# EAGLE design indicator (EAGLE 5.10)
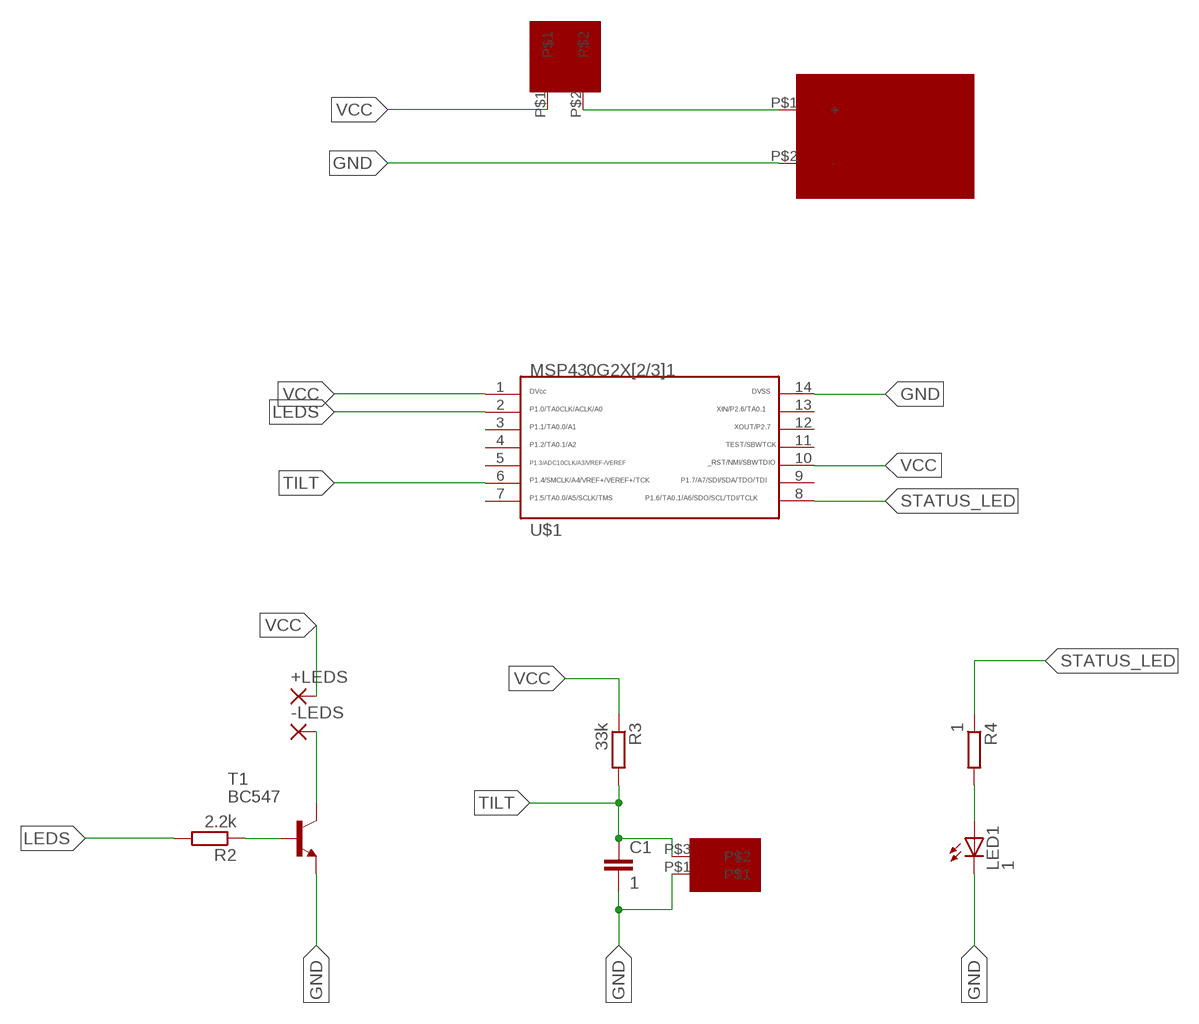
[diagram p0: schematic, sheet 1]

## Parts
+LEDS  PAD-TERMINAL  [1,6/0,8]
-LEDS  PAD-TERMINAL  [1,6/0,8]
BATTERY  BATTERY_HOLDER_CR2032  [BATTERY]
C1  1  C5P  [C050-030-075]
LED1  1  LED5MM  [LED5MM]
R2  2.2k  R  [0207/10]
R3  33k  R  [0207/10]
R4  1  R  [0207/10]
SWITCH  SPDT  [SPDT_SWTICHT]
T1  BC547  [TO92]
TILT  TILT_SWITCH  [TILT_SWITCH]
U$1  G2X[2/3]1---N14  [N14]

## Nets
GND: BATTERY.P$2(-) C1.2 LED1.K(C) T1.1(E) TILT.P$1 U$1.14
LEDS: R2.2 U$1.2
N$2: -LEDS.1(P) T1.3(C)
N$3: R2.1 T1.2(B)
N$11: LED1.A R4.2
N$13: BATTERY.P$1(+) SWITCH.P$2
STATUS_LED: R4.1 U$1.8
TILT: C1.1 R3.2 TILT.P$3 U$1.6
VCC: +LEDS.1(P) R3.1 SWITCH.P$1 U$1.1 U$1.10
Unconnected: U$1.3 U$1.4 U$1.5 U$1.7 U$1.9 U$1.11 U$1.12 U$1.13

## Library data of the parts
+LEDS -LEDS = arm-parts:PAD-TERMINAL: THROUGH-HOLE PAD
BATTERY = Battery_holder_cr2032:BATTERY_HOLDER_CR2032
C1 = arm-parts:C: Capacitor
LED1 = led:LED: LED OSRAM: - CHIPLED LG R971, LG N971, LY N971, LG Q971, LY Q971, LO R971, LY R971 LH N974, LH R974 LS Q976, LO Q976, LY Q976 LO Q996 - Hyper CHIPLED LW Q18S LB Q993, LB Q99A, LB R99A - SideLED LS A670, LO A670, LY A670, LG A670, LP A670 LB A673, LV A673, LT A673, LW A673 LH A674 LY A675 LS A676, LA A676, LO A676, LY A676, LW A676 LS A679, LY A679, LG A679 - Hyper Micro SIDELED® LS Y876, LA Y876, LO Y876, LY Y876 LT Y87S - SmartLED LW L88C, LW L88S LB L89C, LB L89S, LG L890 LS L89K, LO L89K, LY L89K LS L896, LA L896, LO L896, LY L896 - TOPLED LS T670, LO T670, LY T670, LG T670, LP T670 LSG T670, LSP T670, LSY T670, LOP T670, LYG T670 LG T671, LOG T671, LSG T671 LB T673, LV T673, LT T673, LW T673 LH T674 LS T676, LA T676, LO T676, LY T676, LB T676, LH T676, LSB T676, LW T676 LB T67C, LV T67C, LT T67C, LS T67K, LO T67K, LY T67K, LW E67C LS E67B, LA E67B, LO E67B, LY E67B, LB E67C, LV E67C, LT E67C LW T67C LS T679, LY T679, LG T679 LS T770, LO T770, LY T770, LG T770, LP T770 LB T773, LV T773, LT T773, LW T773 LH T774 LS E675, LA E675, LY E675, LS T675 LS T776, LA T776, LO T776, LY T776, LB T776 LHGB T686 LT T68C, LB T68C - Hyper Mini TOPLED® LB M676 - Mini TOPLED Santana® LG M470 LS M47K, LO M47K, LY M47K Source: http://www.osram.convergy.de LUXEON: - LUMILED® LXK2-PW12-R00, LXK2-PW12-S00, LXK2-PW14-U00, LXK2-PW14-V00 LXK2-PM12-R00, LXK2-PM12-S00, LXK2-PM14-U00 LXK2-PE12-Q00, LXK2-PE12-R00, LXK2-PE12-S00, LXK2-PE14-T00, LXK2-PE14-U00 LXK2-PB12-K00, LXK2-PB12-L00, LXK2-PB12-M00, LXK2-PB14-N00, LXK2-PB14-P00, LXK2-PB14-Q00 LXK2-PR12-L00, LXK2-PR12-M00, LXK2-PR14-Q00, LXK2-PR14-R00 LXK2-PD12-Q00, LXK2-PD12-R00, LXK2-PD12-S00 LXK2-PH12-R00, LXK2-PH12-S00 LXK2-PL12-P00, LXK2-PL12-Q00, LXK2-PL12-R00 Source: www.luxeon.com KINGBRIGHT: KA-3528ASYC Source: www.kingbright.com
R2-R4 = arm-parts:R: Resistor
SWITCH = SPDT_SWTICH:SPDT
T1 = transistor-neu-to92:BC547: NPN TRANSISTOR
TILT = tilt_switch:TILT_SWITCH: designed by lorenz gruber for the indicator project
U$1 = TI_MSP430_v16:G2X[2/3]1---N14: MSP430G2X[2/3]1 PDIP (N) 14 Pin Package http://focus.ti.com/docs/prod/folders/print/msp430g2221.html MSP430G2121, MSP430G2221, MSP430G2131

## Board
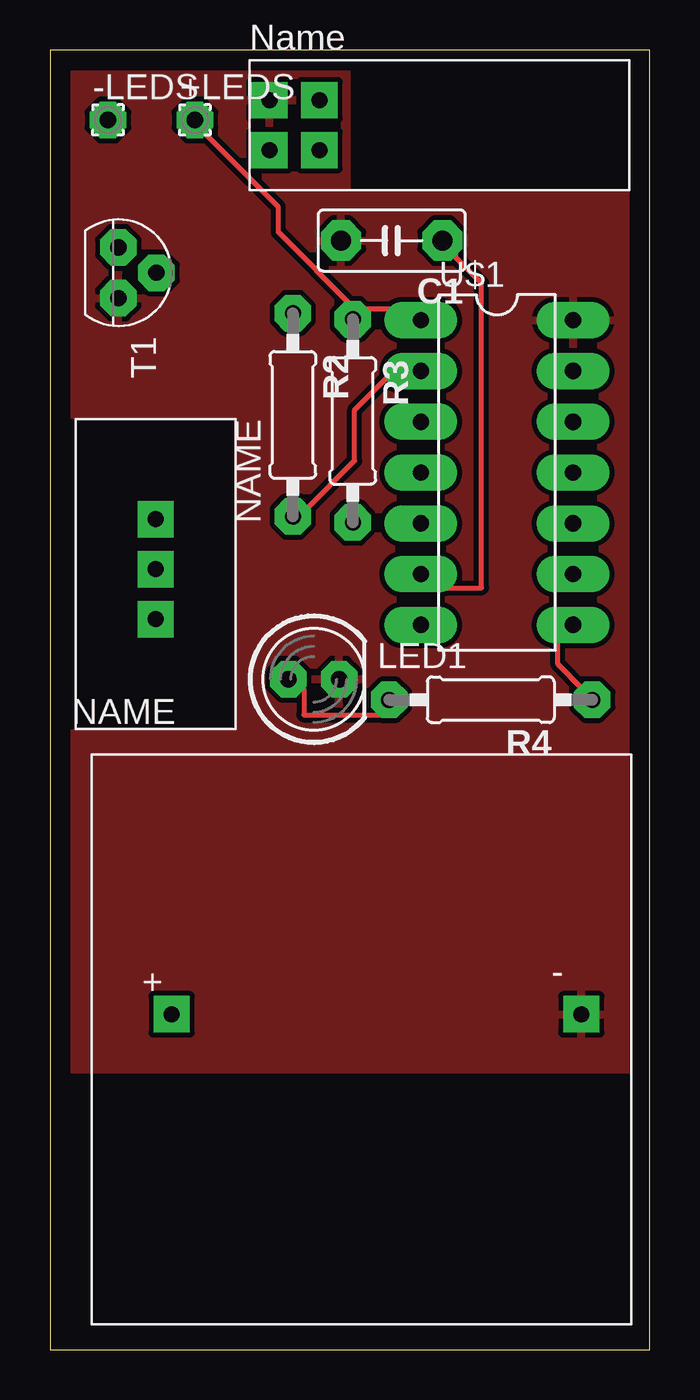
[diagram p1: board, top side]
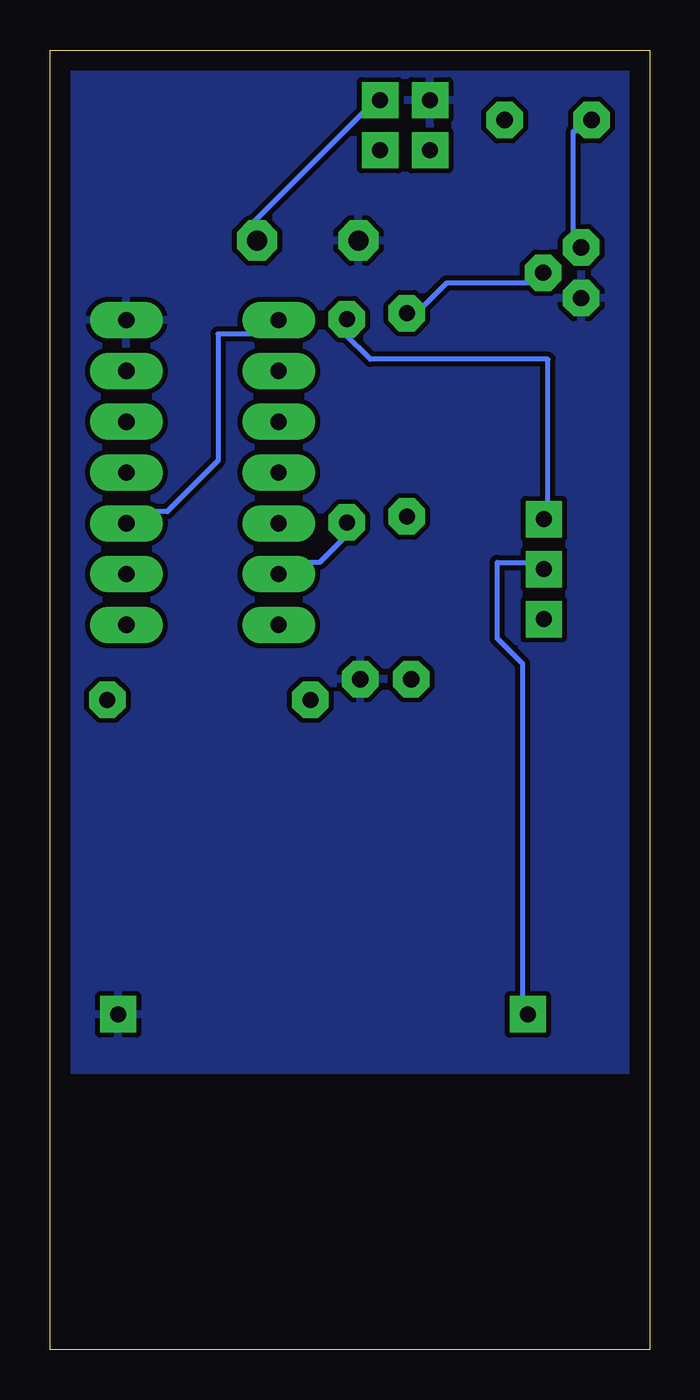
[diagram p2: board, bottom side, seen from below]

Size 30 x 65 mm. Coordinates in mm from the lower left corner, seen from the top.
Outline: 0,0 30,0 30,65 0,65 0,0
Copper layers (1*16): Top 0.035mm / dielectric 1.5mm / Bottom 0.035mm
Design rules "default *": minimum track width 10mil, minimum drill 24mil, track to track 10mil, track to pad 10mil, pad to pad 10mil, via to via 10mil, smd to smd 8mil, copper to edge 40mil, drill to drill 12mil, minimum pad ring 20mil, minimum via ring 15mil, stop-mask expansion 4mil, vias tented up to drill 0mil, thermal gap 10mil

### Footprints (pad centres in the part's own frame; a part is rotated, then mirrored left to right if it is on the bottom)
1,6/0,8 = drill 0.813 pad 1.6 octagon: 1 0,0
BATTERY = drill 0.8 square: P$1 5,15.5; P$2 25.5,15.5
C050-030-075 = drill 1 octagon: 1 -2.54,0; 2 2.54,0
LED5MM = drill 0.813 octagon: A -1.27,0; K 1.27,0
0207/10 = drill 0.8 octagon: 1 -5.08,0; 2 5.08,0
SPDT_SWTICHT = drill 0.8 square: P$1 5,4; P$2 7.5,4; P$3 10,4
TO92 = drill 0.813 octagon: 1 1.27,0; 2 0,1.905; 3 -1.27,0
TILT_SWITCH = drill 0.8 square: P$1 1,4.5; P$2 1,2; P$3 3.5,4.5; P$4 3.5,2
N14 = drill 0.813 long: 1 -7.625,-3.81; 2 -5.085,-3.81; 3 -2.545,-3.81; 4 -0.005,-3.81; 5 2.535,-3.81; 6 5.075,-3.81; 7 7.615,-3.81; 8 7.615,3.81; 9 5.075,3.81; 10 2.535,3.81; 11 -0.005,3.81; 12 -2.545,3.81; 13 -5.085,3.81; 14 -7.625,3.81

### Placement (x,y rotation side)
+LEDS  7.25,61.5 0 top
-LEDS  2.9,61.5 0 top
BATTERY  1.09,1.27 0 top
C1  17.1,55.47 180 top
LED1  13.2,33.53 0 top
R2  12.15,46.75 270 top
R3  15.15,46.45 270 top
R4  22.05,32.5 180 top
SWITCH  1.29,46.53 270 top
T1  3.42,53.86 270 top
TILT  9.98,57.99 0 top
U$1  22.37,43.86 270 top

### Tracks (layer width: path | path; a pad name or v marks a point on that pad's centre or on a via)
GND
  pour Bottom: 1,64 29,64 29,63 29,14 1,14
  pour Top: 1,64 29,64 29,14 1,14
LEDS
  Top 0.254: R2.2 12.7,41.91 15.24,44.45 15.24,46.99 17.78,49.53 U$1.2
N$2
  Bottom 0.254: T1.3 3.81,55.88 3.81,60.96 2.54,60.96 -LEDS.1
N$3
  Bottom 0.254: R2.1 11.43,52.07 10.16,53.34 5.08,53.34 T1.2
N$11
  Top 0.254: R4.2 16.51,31.75 12.7,31.75 12.7,33.02 LED1.A
N$13
  Bottom 0.254: BATTERY.P$1 6.35,16.51 6.35,34.29 7.62,35.56 7.62,39.37 5.08,39.37 SWITCH.P$2
STATUS_LED
  Top 0.254: R4.1 26.67,33.02 25.4,34.29 25.4,35.56 U$1.8
TILT
  Top 0.254: U$1.6 19.05,38.1 21.59,38.1 21.59,53.34 20.32,54.61 20.32,55.88 C1.1
  Bottom 0.254: R3.2 15.24,40.64 16.51,39.37 17.78,39.37 U$1.6 | TILT.P$3 13.97,62.23 20.32,55.88 C1.1
VCC
  Top 0.254: 15.24,52.07 17.78,52.07 U$1.1 | 15.24,52.07 11.43,55.88 11.43,57.15 7.62,60.96 +LEDS.1 | R3.1 15.24,52.07
  Bottom 0.254: SWITCH.P$1 5.08,41.91 5.08,49.53 13.97,49.53 15.24,50.8 R3.1 | U$1.10 25.4,41.91 24.13,41.91 21.59,44.45 21.59,50.8 19.05,50.8 U$1.1